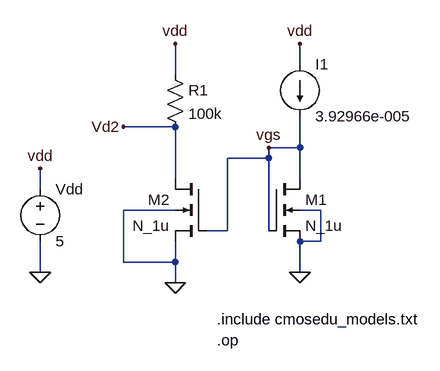
[diagram p0: schematic pt4.asc]
pt4.asc, the LTspice schematic file:
Version 4
SHEET 1 880 680
WIRE 176 -48 176 -80
WIRE -16 -32 -16 -80
WIRE -16 48 -96 48
WIRE 176 80 176 32
WIRE 176 80 128 80
WIRE 128 96 128 80
WIRE 128 96 64 96
WIRE -16 128 -16 48
WIRE 176 128 176 80
WIRE -224 144 -224 112
WIRE -16 176 -96 176
WIRE 208 176 176 176
WIRE 64 208 64 96
WIRE 64 208 32 208
WIRE 128 208 128 96
WIRE 208 224 208 176
WIRE 208 224 176 224
WIRE -96 256 -96 176
WIRE -16 256 -16 224
WIRE -16 256 -96 256
WIRE -224 272 -224 224
WIRE 176 272 176 224
WIRE -16 288 -16 256
FLAG 176 272 0
FLAG 176 -80 vdd
FLAG -224 272 0
FLAG -224 112 vdd
FLAG -16 -80 vdd
FLAG -96 48 Vd2
FLAG -16 288 0
FLAG 128 80 vgs
SYMBOL nmos4 128 128 R0
SYMATTR InstName M1
SYMATTR Value N_1u
SYMATTR Value2 l=1.5u w=3u
SYMBOL current 176 -48 R0
WINDOW 123 0 0 Left 2
WINDOW 39 0 0 Left 2
SYMATTR InstName I1
SYMATTR Value 3.92966e-005
SYMBOL voltage -224 128 R0
WINDOW 123 0 0 Left 2
WINDOW 39 0 0 Left 2
SYMATTR InstName Vdd
SYMATTR Value 5
SYMBOL nmos4 32 128 M0
SYMATTR InstName M2
SYMATTR Value N_1u
SYMATTR Value2 l=1.5u w=3u
SYMBOL res -32 -48 R0
SYMATTR InstName R1
SYMATTR Value 100k
TEXT 48 344 Left 2 !.include cmosedu_models.txt
TEXT 48 376 Left 2 !.op

The netlist it stands for:
* pt4.asc
M1 vgs vgs 0 0 N_1u l=1.5u w=3u
I1 vdd vgs 3.92966e-005
Vdd vdd 0 5
M2 Vd2 vgs 0 0 N_1u l=1.5u w=3u
R1 vdd Vd2 100k
.model NMOS NMOS
.model PMOS PMOS
.lib standard.mos
.include cmosedu_models.txt
.op
.backanno
.end

* Results of the author's LTspice run, read from the files saved beside the schematic
* Operating Point:
*   V(vgs) = 1.5 V
*   V(vdd) = 5 V
*   V(vd2) = 1.11 V
*   Id(M2) = 38.9 µA
*   Ig(M2) = 0 A
*   Ib(M2) = -1.12 pA
*   Is(M2) = -38.9 µA
*   Id(M1) = 39.3 µA
*   Ig(M1) = 0 A
*   Ib(M1) = -1.51 pA
*   Is(M1) = -39.3 µA
*   I(I1) = 39.3 µA
*   I(R1) = 38.9 µA
*   I(Vdd) = -78.2 µA
* From the log:
*   Semiconductor Device Operating Points:
*                           --- MOSFET Transistors ---
*   Name:          m2          m1
*   Model:        n_1u        n_1u
*   Id:          3.89e-05    3.93e-05
*   Vgs:         1.50e+00    1.50e+00
*   Vds:         1.11e+00    1.50e+00
*   Vbs:         0.00e+00    0.00e+00
*   Vth:         8.90e-01    8.90e-01
*   Vdsat:       4.74e-01    4.74e-01
*   Gm:          1.00e-04    1.01e-04
*   Gds:         4.45e-06    4.28e-06
*   Gmb:         3.41e-05    3.45e-05
*   Cbd:         0.00e+00    0.00e+00
*   Cbs:         0.00e+00    0.00e+00
*   Cgsov:       6.00e-16    6.00e-16
*   Cgdov:       6.00e-16    6.00e-16
*   Cgbov:       1.30e-16    1.30e-16
*   Cgs:         4.49e-15    4.49e-15
*   Cgd:         0.00e+00    0.00e+00
*   Cgb:         0.00e+00    0.00e+00